# Altium project bpq123.PrjPcb
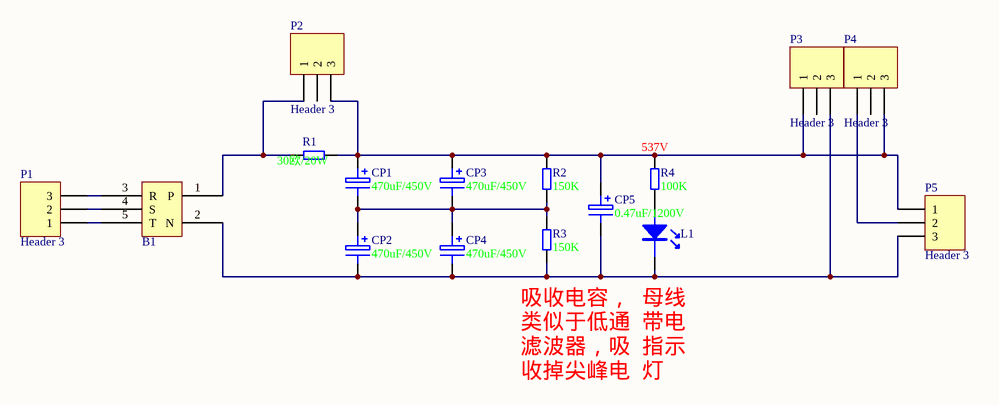
[diagram p0: bpq123.SchDoc]
1 sheet, 16 parts. Net scope: global (net labels, ports and power ports of the same name join across sheets).
Board file: bpq123.PcbDoc

## Sheet bpq123.SchDoc
size A4

### Parts
B1  3BRIDGE  [三相整流桥]  (value not drawn)
CP1  470uF/450V  [CAP_35X50]
CP2  470uF/450V  [CAP_35X50]
CP3  470uF/450V  [CAP_35X50]
CP4  470uF/450V  [CAP_35X50]
CP5  0.47uF/1200V  [CB2]
L1  LED  [LED_1206]  (value not drawn)
P1  Header 3  [30A/300V]
P2  Header 3  [30A/300V]
P3  Header 3  [5.25-3]
P4  Header 3  [5.25-3]
P5  Header 3  [30A/300V]
R1  30欧/20W  [R_30R/20W]
R2  150K  [AXIAL0.7]
R3  150K  [AXIAL0.7]
R4  100K  [AXIAL0.7]

### Nets
NetB1_1: B1.1(P) P2.1 R1.1
NetB1_2: B1.2(N) CP2.2 CP4.2 CP5.2 L1.2 P3.3 P5.3 R3.1
NetB1_3: B1.3(R) P1.3
NetB1_4: B1.4(S) P1.2
NetB1_5: B1.5(T) P1.1
NetCP1_1: CP1.1 CP3.1 CP5.1 P2.3 P3.1 P4.3 P5.1 R1.2 R2.2 R4.2
NetCP1_2: CP1.2 CP2.1 CP3.2 CP4.1 R2.1 R3.2
NetL1_1: L1.1 R4.1
NetP4_1: P4.1 P5.2

Not connected (* = marked no-connect by the designer): P2 2; P3 2; P4 2

### Notes on the sheet
- (near R4) 537V
- 吸收电容，类似于低通滤波器，吸收掉尖峰电压。
- (near L1) 母线带电指示灯

### Library data of the parts
B1 = 三相整流桥
CP1-CP5 = Cap_Pol: 极性电容
L1 = LED: 发光二极管
P1-P5 = Header 3: Header, 3-Pin; LatestRevisionDate: 17-Jul-2002; LatestRevisionNote: Re-released for DXP Platform.; Publisher: Altium Limited
R1-R4 = Res: 电阻